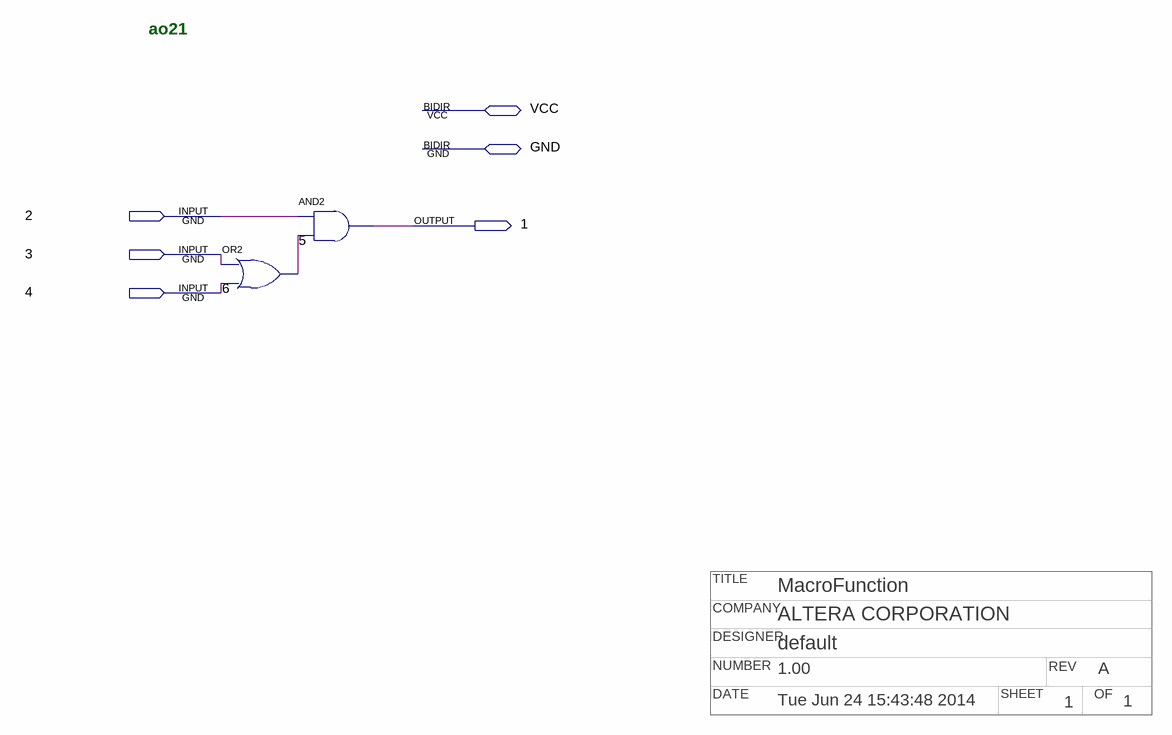
[diagram p0: schematic sheet]
// Quartus schematic npao21.bdf as structural Verilog: 2 symbols, 6 pins
// Title block: TITLE: MacroFunction; COMPANY: ALTERA CORPORATION; DESIGNER: default; NUMBER: 1.00; REV: A; DATE: Tue Jun 24 15:43:48 2014; SHEET: 1; OF: 1
module npao21 (
  input  \2 ,
  input  \3 ,
  input  \4 ,
  inout  VCC,
  inout  GND,
  output \1 
);

  wire n6_out;

  or u_6 (n6_out, \3 , \4 );
  and u_5 (\1 , \2 , n6_out);

  // Notes on the sheet:
  //   ao21
endmodule
